# Altium schematic sheet Sheet_dht11.SchDoc
size A4
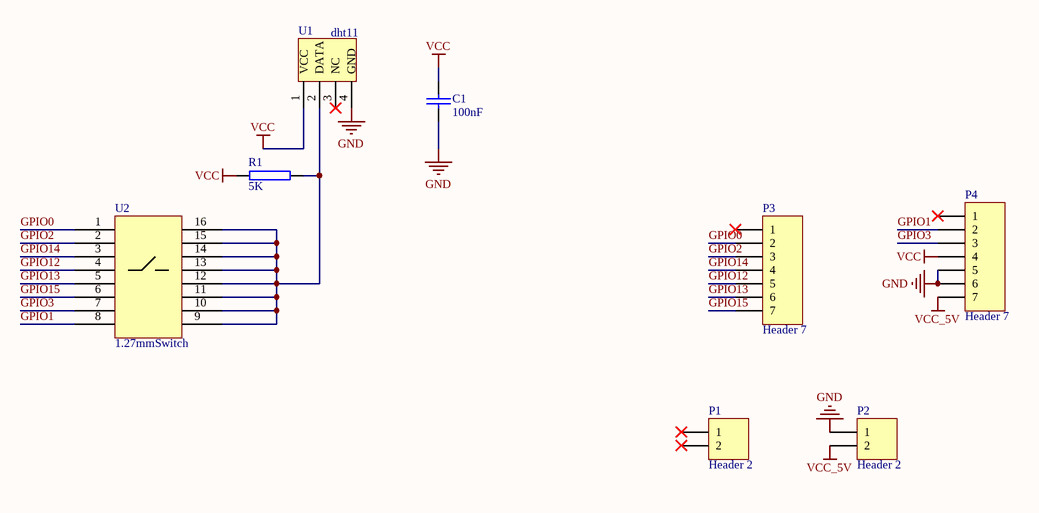
[diagram p0: Sheet_dht11.SchDoc]

## Parts
C1  100nF  [C0603]
P1  Header 2  [HDR1X2]
P2  Header 2  [HDR1X2]
P3  Header 7  [HDR1X7]
P4  Header 7  [HDR1X7]
R1  5K  [R0603]
U1  dht11  [dht11]
U2  1.27mmSwitch  [NumberSwitch]

## Nets
GND: C1.2 P2.1 P4.5 P4.6 U1.4(GND)
VCC: C1.1 P4.4 R1.1 U1.1(VCC)
VCC_5V: P2.2 P4.7
GPIO0: P3.2 U2.1
GPIO1: P4.2 U2.8
GPIO2: P3.3 U2.2
GPIO3: P4.3 U2.7
GPIO12: P3.5 U2.4
GPIO13: P3.6 U2.5
GPIO14: P3.4 U2.3
GPIO15: P3.7 U2.6
NetR1_2: R1.2 U1.2(DATA) U2.9 U2.10 U2.11 U2.12 U2.13 U2.14 U2.15 U2.16

Not connected (* = marked no-connect by the designer): P1 1* 2*; P3 1*; P4 1*; U1 3(NC)*

## Library data of the parts
C1 = C0603: 贴片电容
P1 P2 = Header 2: Header, 2-Pin; LatestRevisionDate: 17-Jul-2002; LatestRevisionNote: Re-released for DXP Platform.; Publisher: Altium Limited
P3 P4 = Header 7: Header, 7-Pin; LatestRevisionDate: 17-Jul-2002; LatestRevisionNote: Re-released for DXP Platform.; Publisher: Altium Limited
R1 = R0603: 贴片电阻
U1 = dht11: 温湿度传感器
U2 = NumberSwitch: 拨码开关